# Altium schematic sheet Sheet_1_2022-03-15.schdoc
size 429 x 235 mm
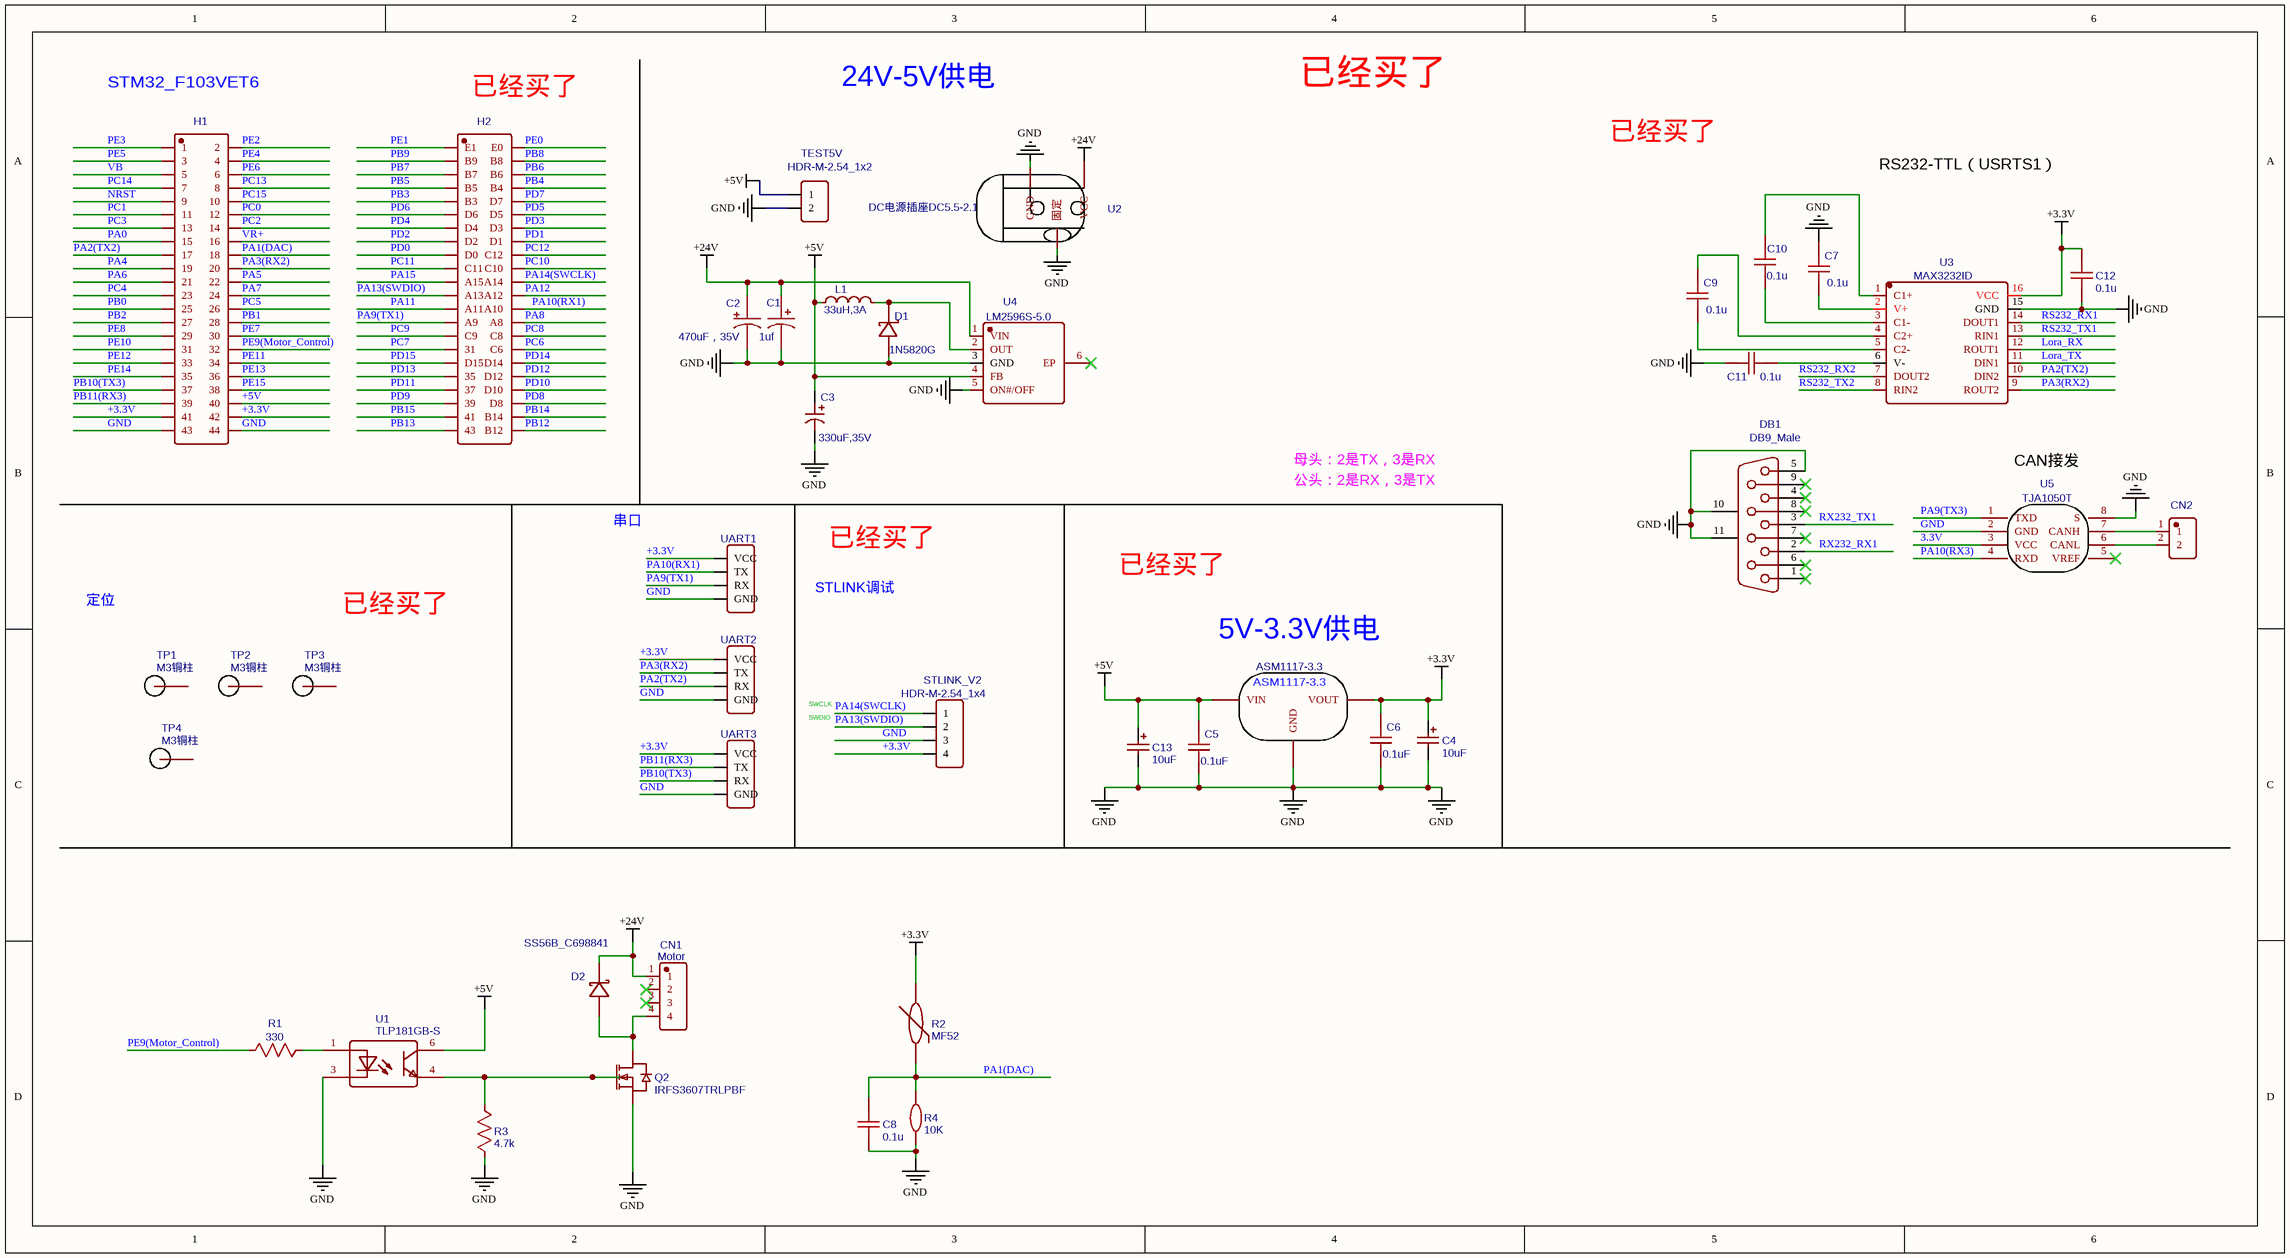
[diagram p0: Sheet_1_2022-03-15.schdoc]

## Parts
5V-3.3V  ASM1117-3.3  [ASM1117-5.0-SOT223]
C1  1uf  [CASE-A_3216]
C2  470uF，35V  [CAP-SMD_BD10.0-L10.3-W10.3-FD]
C3  330uF,35V  [CAP-SMD_BD10.0-L10.3-W10.3-LS11.0-FD]
C4  10uF  [CAP-SMD_L3.2-W1.6-R-RD]
C5  0.1uF  [C0603]
C6  0.1uF  [C0603]
C7  0.1u  [C0603]
C8  0.1u  [C0603]
C9  0.1u  [C0603]
C10  0.1u  [C0603]
C11  0.1u  [C0603]
C12  0.1u  [C0603]
C13  10uF  [CAP-SMD_L3.2-W1.6-R-RD]
CN1  Motor  [CONN-TH_4P-P3.81_DB2EVC-3.81-4P]
CN2  XY2500V-E-3.81-2P  [CONN-TH_XY2500V-E-3.81-2P]  (value not drawn)
D1  1N5820G  [DO-201AD_BD5.3-L8.4-P12.50-D1.4-RD]
D2  SS56B_C698841  [SMB_L4.6-W3.6-LS5.3-RD]
DB1  DB9_Male  [DSUB-TH_DMR-9P]
H1  X5521FV-2X22C70D30-1000  [HDR-TH_44P-P2.54-V-F-R2-C22-S2.54]  (value not drawn)
H2  从5  [HDR-TH_44P-P2.54-V-F-R2-C22-S2.54]  (value not drawn)
L1  33uH,3A  [IND-SMD_L11.5-W10.0_SMMS1040]
Q2  IRFS3607TRLPBF  [TO-263-2_L10.0-W9.1-P5.08-LS15.2-TL]
R1  330  [R0603]
R2  MF52  [RES-TH_L2.5-W2.5-P1.70-D0.3]
R3  4.7k  [R0805]
R4  10K  [R0805]
STLINK_V2  HDR-M-2.54_1x4  [HDR-M-2.54_1X4]
TEST5V  HDR-M-2.54_1x2  [HDR-M-2.54_1X2]
TP1  M3铜柱  [M3铜柱]
TP2  M3铜柱  [M3铜柱]
TP3  M3铜柱  [M3铜柱]
TP4  M3铜柱  [M3铜柱]
U1  TLP181GB-S  [SOP-4_L3.7-W4.6-P2.54-LS7.0-TL]
U2  DC电源插座DC5.5-2.1  [DC电源插座5.5-2.1]
U3  MAX3232ID  [SOIC-16_L9.9-W3.9-P1.27-LS6.0-BL]
U4  LM2596S-5.0  [TO-263-5_L10.2-W8.9-P1.70-BR]
U5  TJA1050T  [SOIC-8_L5.0-W4.0-P1.27-LS6.0-BL]
UART1  HDR-M-2.54_1x4  [HDR-M-2.54_1X4]  (value not drawn)
UART2  HDR-M-2.54_1x4  [HDR-M-2.54_1X4]  (value not drawn)
UART3  HDR-M-2.54_1x4  [HDR-M-2.54_1X4]  (value not drawn)

## Nets
+3.3V: 5V-3.3V.2(VOUT) C4.1 C6.2 C12.2 H1.41 H1.42 R2.2 STLINK_V2.4 U3.16(VCC) UART1.1(VCC) UART2.1(VCC) UART3.1(VCC)
+5V: 5V-3.3V.3(VIN) C3.1 C5.2 C13.1 H1.40 L1.1 TEST5V.1 U1.6(COL) U4.4(FB)
+24V: C1.1 C2.1 CN1.1 D2.1(K) U2.1(VCC) U4.1(VIN)
GND: 5V-3.3V.1(GND) C1.2 C2.2 C3.2 C4.2 C5.1 C6.1 C7.2 C8.1 C11.1 C12.1 C13.2 D1.2(A) DB1.5 DB1.10(MH1) DB1.11(MH2) H1.43 H1.44 Q2.3(S) R3.1 R4.1 STLINK_V2.3 TEST5V.2 U1.3(CAT) U2.2(GND) U2.3(固定) U3.15(GND) U4.3(GND) U4.5(ON#/OFF) U5.2(GND) U5.8(S) UART1.4(GND) UART2.4(GND) UART3.4(GND)
3.3V: U5.3(VCC)
Lora_RX: U3.12(ROUT1)
Lora_TX: U3.11(DIN1)
NRST: H1.9
PA0: H1.15
PA1(DAC): C8.2 H1.18 R2.1 R4.2
PA2(TX2): H1.17 U3.10(DIN2) UART2.3(RX)
PA3(RX2): H1.20 U3.9(ROUT2) UART2.2(TX)
PA4: H1.19
PA5: H1.22
PA6: H1.21
PA7: H1.24
PA8: H2.28(A8)
PA9(TX1): H2.27(A9) UART1.3(RX)
PA9(TX3): U5.1(TXD)
PA10(RX1): H2.26(A10) UART1.2(TX)
PA10(RX3): U5.4(RXD)
PA11: H2.25(A11)
PA12: H2.24(A12)
PA13(SWDIO): H2.23(A13) STLINK_V2.2
PA14(SWCLK): H2.22(A14) STLINK_V2.1
PA15: H2.21(A15)
PB0: H1.25
PB1: H1.28
PB2: H1.27
PB3: H2.9(B3)
PB4: H2.8(B4)
PB5: H2.7(B5)
PB6: H2.6(B6)
PB7: H2.5(B7)
PB8: H2.4(B8)
PB9: H2.3(B9)
PB10(TX3): H1.37 UART3.3(RX)
PB11(RX3): H1.39 UART3.2(TX)
PB12: H2.44(B12)
PB13: H2.43
PB14: H2.42(B14)
PB15: H2.41
PC0: H1.12
PC1: H1.11
PC2: H1.14
PC3: H1.13
PC4: H1.23
PC5: H1.26
PC6: H2.32(C6)
PC7: H2.31
PC8: H2.30(C8)
PC9: H2.29(C9)
PC10: H2.20(C10)
PC11: H2.19(C11)
PC12: H2.18(C12)
PC13: H1.8
PC14: H1.7
PC15: H1.10
PD0: H2.17(D0)
PD1: H2.16(D1)
PD2: H2.15(D2)
PD3: H2.14(D3)
PD4: H2.13(D4)
PD5: H2.12(D5)
PD6: H2.11(D6)
PD7: H2.10(D7)
PD8: H2.40(D8)
PD9: H2.39
PD10: H2.38(D10)
PD11: H2.37
PD12: H2.36(D12)
PD13: H2.35
PD14: H2.34(D14)
PD15: H2.33(D15)
PE0: H2.2(E0)
PE1: H2.1(E1)
PE2: H1.2
PE3: H1.1
PE4: H1.4
PE5: H1.3
PE6: H1.6
PE7: H1.30
PE8: H1.29
PE9(Motor_Control): H1.32 R1.1
PE10: H1.31
PE11: H1.34
PE12: H1.33
PE13: H1.36
PE14: H1.35
PE15: H1.38
RS232_RX1: U3.14(DOUT1)
RS232_RX2: U3.7(DOUT2)
RS232_TX1: U3.13(RIN1)
RS232_TX2: U3.8(RIN2)
RX232_RX1: DB1.2
RX232_TX1: DB1.3
VB: H1.5
VR+: H1.16
NetC7_1: C7.1 U3.2(V+)
NetC9_1: C9.1 U3.5(C2-)
NetC9_2: C9.2 U3.4(C2+)
NetC10_1: C10.1 U3.3(C1-)
NetC10_2: C10.2 U3.1(C1+)
NetC11_2: C11.2 U3.6(V-)
NetCN1_4: CN1.4 D2.2(A) Q2.4(D)
NetCN2_1: CN2.1 U5.7(CANH)
NetCN2_2: CN2.2 U5.6(CANL)
NetD1_1: D1.1(C) L1.2 U4.2(OUT)
NetQ2_1: Q2.1(G) R3.2 U1.4(EMI)
NetR1_2: R1.2 U1.1(AN)

Not connected (* = marked no-connect by the designer): CN1 2* 3*; DB1 1* 4* 6* 7* 8* 9*; TP1 1(M3); TP2 1(M3); TP3 1(M3); TP4 1(M3); U4 6(EP)*; U5 5(VREF)*

## Notes on the sheet
- STM32_F103VET6
- (near H2) 已经买了
- 24V-5V供电
- 已经买了
- RS232-TTL（USRTS1）
- 母头：2是TX，3是RX
- CAN接发
- 串口
- 公头：2是RX，3是TX
- 定位
- STLINK调试
- (near 5V-3.3V) 5V-3.3V供电
- SWDIO
- SWCLK

## Library data of the parts
5V-3.3V = ASM1117-3.3: Contributor: 15770626102wlh; Package Display: No; spicePre: U; spiceSymbolName: ASM1117-3.3
C1 = 1uf: nameAlias: Value(F); Contributor: LCEDA_Lib; spicePre: C; spiceSymbolName: C_Tan_SMD_A_US
C2 = 470uF，35V: BOM_Manufacturer: Nichicon; BOM_Manufacturer Part: UWT1H221MNL1GS; nameAlias: Capacitance; Contributor: LCSC; BOM_Supplier: LCSC; BOM_Supplier Part: C125977; BOM_JLCPCB Part Class: Extended Part; spicePre: C; spiceSymbolName: UWT1H221MNL1GS
C3 = 330uF,35V: BOM_Manufacturer: KNSCHA(科尼盛); BOM_Manufacturer Part: RVT330UF35V67RV0163; Contributor: LCSC; BOM_Supplier: LCSC; BOM_Supplier Part: C2895285; spicePre: C; spiceSymbolName: RVT330UF35V67RV0163
C4 C13 = 10uF: BOM_Manufacturer: Sunlord; BOM_Manufacturer Part: TC212A106K016Y; nameAlias: Capacitance; BOM_Supplier: LCSC; BOM_Supplier Part: C108529; BOM_JLCPCB Part Class: Extended Part; spicePre: C; spiceSymbolName: TC212A106K016Y
C5 C6 = 0.1uF: nameAlias: Value(F); Contributor: LCEDA_Lib; spicePre: C; spiceSymbolName: C_0603_US
C7-C12 = 0.1u: nameAlias: Value(F); Contributor: LCEDA_Lib; spicePre: C; spiceSymbolName: C_0603_US
CN1 = Motor: BOM_Manufacturer: DIBO; BOM_Manufacturer Part: DB2EVC-3.81-4P; Contributor: LCSC; BOM_Supplier: LCSC; BOM_Supplier Part: C395697; BOM_JLCPCB Part Class: Extended Part; spicePre: C; spiceSymbolName: DB2EVC-3.81-4P
CN2 = XY2500V-E-3.81-2P: BOM_Manufacturer: Ningbo Xinlaiya Elec.; Contributor: LCSC; BOM_Supplier: LCSC; BOM_Supplier Part: C880563; BOM_Manufacturer Part: XY2500V-E-3.81-2P; BOM_JLCPCB Part Class: Extended Part; spicePre: C; spiceSymbolName: XY2500V-E-3.81-2P
D1 = 1N5820G: BOM_Manufacturer: ON Semicon; Contributor: LCSC; BOM_Supplier: LCSC; BOM_Supplier Part: C95400; BOM_Manufacturer Part: 1N5820G; BOM_JLCPCB Part Class: Extended Part; spicePre: D; spiceSymbolName: 1N5820G
D2 = SS56B_C698841: BOM_Manufacturer: Yangzhou Yangjie Elec Tech; BOM_Manufacturer Part: SS56B; Contributor: LCSC; BOM_Supplier: LCSC; BOM_Supplier Part: C698841; BOM_JLCPCB Part Class: Extended Part; spicePre: D; spiceSymbolName: SS56B_C698841
DB1 = DB9_Male: BOM_Manufacturer: Amphenol; Contributor: LCEDA_Lib; BOM_Supplier Part: C185657; BOM_Supplier: LCSC; spicePre: D; spiceSymbolName: DB9_Male
H1 = X5521FV-2X22C70D30-1000: BOM_Manufacturer: XKB Connectivity; Contributor: LCSC; Package Display: No; BOM_Supplier: LCSC; BOM_Supplier Part: C2682209; BOM_Manufacturer Part: X5521FV-2x22C70D30-1000; spicePre: H; spiceSymbolName: X5521FV-2X22C70D30-1000
H2 = 从5: BOM_Manufacturer: XKB Connectivity; BOM_Manufacturer Part: X5521FV-2x22C70D30-1000; Contributor: LCSC; Package Display: No; BOM_Supplier: LCSC; BOM_Supplier Part: C2682209; spicePre: H; spiceSymbolName: X5521FV-2X22C70D30-1000
L1 = 33uH,3A: BOM_Manufacturer: YJYCOIN; BOM_Manufacturer Part: YSPI1050-330M; nameAlias: Inductance; Contributor: LCSC; BOM_Supplier: LCSC; BOM_Supplier Part: C497900; BOM_JLCPCB Part Class: Extended Part; spicePre: L; spiceSymbolName: YSPI1050-330M
Q2 = IRFS3607TRLPBF: BOM_Manufacturer: IR; BOM_Supplier: LCSC; BOM_Manufacturer Part: IRFS3607TRLPBF; BOM_Supplier Part: C22162; BOM_JLCPCB Part Class: Extended Part; spicePre: Q; spiceSymbolName: IRFS3607TRLPBF
R1 = 330: nameAlias: Value(Ω); Contributor: LCEDA_Lib; spicePre: R; spiceSymbolName: R_0603_US
R2 = MF52: BOM_Manufacturer: Shiheng; BOM_Manufacturer Part: MF52A1104F3950(P209-15A); nameAlias: Value; BOM_Supplier: LCSC; BOM_Supplier Part: C13424; BOM_JLCPCB Part Class: Extended Part; spicePre: R; spiceSymbolName: MF52A1104F3950(P209-15A)
R3 = 4.7k: nameAlias: Value(Ω); Contributor: LCEDA_Lib; spicePre: R; spiceSymbolName: R_0805_US
R4 = 10K: BOM_Manufacturer: Ever Ohms Tech; BOM_Manufacturer Part: TR0805B10KP0525; nameAlias: Resistance (Ohms); Contributor: LCSC; BOM_Supplier: LCSC; BOM_Supplier Part: C188360; BOM_JLCPCB Part Class: Extended Part; spicePre: R; spiceSymbolName: TR0805B10KP0525
STLINK_V2 UART1-UART3 = HDR-M-2.54_1x4: Contributor: LCEDA_Lib; BOM_Supplier Part: C124378; BOM_Supplier: LCSC; spicePre: J; spiceSymbolName: HDR-M-2.54_1x4
TEST5V = HDR-M-2.54_1x2: Contributor: LCEDA_Lib; BOM_Supplier Part: C124375; BOM_Supplier: LCSC; spicePre: J; spiceSymbolName: HDR-M-2.54_1x2
TP1-TP4 = M3铜柱: Contributor: xzxzhao; spicePre: T; spiceSymbolName: M3铜柱
U1 = TLP181GB-S: BOM_Manufacturer: Youtai Semiconductor Co., Ltd.; Contributor: LCSC; BOM_Supplier: LCSC; BOM_Supplier Part: C388374; BOM_Manufacturer Part: TLP181GB-S; BOM_JLCPCB Part Class: Extended Part; spicePre: U; spiceSymbolName: TLP181GB-S
U2 = DC电源插座DC5.5-2.1: Contributor: Ros智能车; spicePre: U; spiceSymbolName: DC电源插座DC5.5-2.1
U3 = MAX3232ID: BOM_Manufacturer: Texas Instruments; Contributor: LCSC; BOM_Supplier: LCSC; BOM_Supplier Part: C354119; BOM_Manufacturer Part: MAX3232ID; BOM_JLCPCB Part Class: Extended Part; spicePre: U; spiceSymbolName: MAX3232ID
U4 = LM2596S-5.0: BOM_Manufacturer: UMW(Youtai Semiconductor Co., Ltd.); Contributor: LCSC; BOM_Supplier: LCSC; BOM_Supplier Part: C347421; BOM_Manufacturer Part: LM2596S-5.0; BOM_JLCPCB Part Class: Extended Part; spicePre: U; spiceSymbolName: LM2596S-5.0
U5 = TJA1050T: BOM_Manufacturer: NXP; BOM_Manufacturer Part: TJA1050T/CM,118; BOM_Supplier: LCSC; BOM_Supplier Part: C6952; BOM_JLCPCB Part Class: Basic Part; spicePre: U; spiceSymbolName: TJA1050T/CM,118